# EAGLE design Naninator7 (EAGLE 7.3.0)
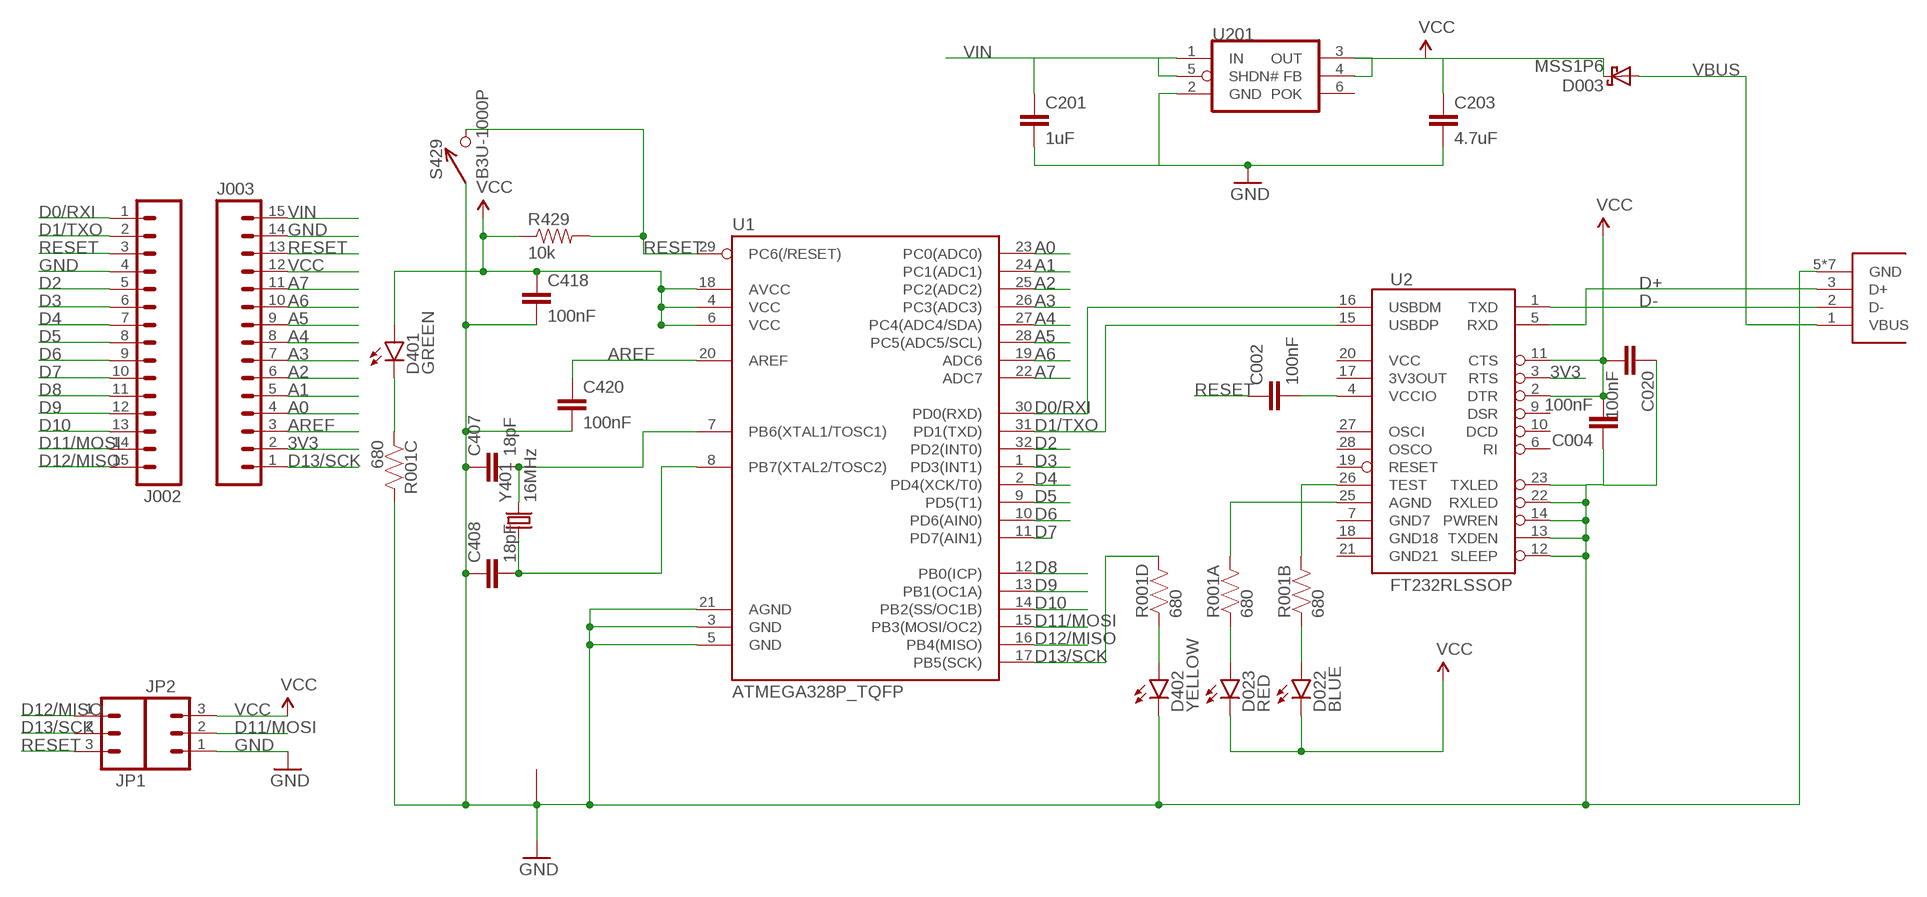
[diagram p0: schematic, sheet 1]

## Parts
C002  100nF  CAP0402-CAP  [0402-CAP]
C004  100nF  CAP0402-CAP  [0402-CAP]
C020  100nF  CAP0402-CAP  [0402-CAP]
C201  1uF  CAP0402-CAP  [0402-CAP]
C203  4.7uF  CAP0402-CAP  [0402-CAP]
C407  18pF  CAP0402-CAP  [0402-CAP]
C408  18pF  CAP0402-CAP  [0402-CAP]
C418  100nF  CAP0402-CAP  [0402-CAP]
C420  100nF  CAP0402-CAP  [0402-CAP]
D003  MSS1P6  [MICROSMP]
D022  BLUE  LED0603  [LED-0603]
D023  RED  LED0603  [LED-0603]
D401  GREEN  LED0603  [LED-0603]
D402  YELLOW  LED0603  [LED-0603]
J001  USB_MICROB_JSTFCI  [USB-MICROB-CONN-09505]
J002  M15  [1X15]
J003  M15  [1X15]
JP1  M03PTH  [1X03]
JP2  M03PTH  [1X03]
R001  680  RP404  [CRA04]
R429  10k  RESISTOR0402-RES  [0402-RES]
S429  B3U-1000P  [B3U-1000P]
U1  ATMEGA328P_TQFP  [TQFP32-08]
U2  FT232RLSSOP  [SSOP28DB]
U201  MAX8881  [SOT-23-6]
Y401  16MHz  CX2520  [CRYSTAL_SMD_2MM_2_5MM]

## Nets
3V3: J003.2 U2.3(RTS)
A0: J003.4 U1.23(PC0(ADC0))
A1: J003.5 U1.24(PC1(ADC1))
A2: J003.6 U1.25(PC2(ADC2))
A3: J003.7 U1.26(PC3(ADC3))
A4: J003.8 U1.27(PC4(ADC4/SDA))
A5: J003.9 U1.28(PC5(ADC5/SCL))
A6: J003.10 U1.19(ADC6)
A7: J003.11 U1.22(ADC7)
AREF: C420.1 J003.3 U1.20(AREF)
D0/RXI: J002.1 U1.30(PD0(RXD)) U2.16(USBDM)
D1/TXO: J002.2 U1.31(PD1(TXD)) U2.15(USBDP)
D2: J002.5 U1.32(PD2(INT0))
D3: J002.6 U1.1(PD3(INT1))
D4: J002.7 U1.2(PD4(XCK/T0))
D5: J002.8 U1.9(PD5(T1))
D6: J002.9 U1.10(PD6(AIN0))
D7: J002.10 U1.11(PD7(AIN1))
D8: J002.11 U1.12(PB0(ICP))
D9: J002.12 U1.13(PB1(OC1A))
D10: J002.13 U1.14(PB2(SS/OC1B))
D11/MOSI: J002.14 JP2.2 U1.15(PB3(MOSI/OC2))
D12/MISO: J002.15 JP1.1 U1.16(PB4(MISO))
D13/SCK: J003.1 JP1.2 R001.5 U1.17(PB5(SCK))
D+: J001.3(D+) U2.5(RXD)
D-: J001.2(D-) U2.1(TXD)
DTR#: C002.2 U2.4(VCCIO)
GND: C004.1 C020.1 C201.2 C203.2 C407.1 C408.1 C418.2 C420.2 D402.C J001.5(GND) J001.P1(GND) J001.P2(GND) J001.P3(GND) J001.P4(GND) J001.P5(GND) J001.P6(GND) J002.4 J003.14 JP2.1 R001.6 S429.P$1 U1.3(GND) U1.5(GND) U1.21(AGND) U2.12(SLEEP) U2.13(TXDEN) U2.14(PWREN) U2.22(RXLED) U2.23(TXLED) U201.2(GND) Y401.2 Y401.4
N$1: C407.2 U1.7(PB6(XTAL1/TOSC1)) Y401.3
N$2: C408.2 U1.8(PB7(XTAL2/TOSC2)) Y401.1
N$3: D401.C R001.3
N$4: D022.A R001.2
N$5: D023.A R001.1
N$8: D402.A R001.4
RESET: C002.1 J002.3 J003.13 JP1.3 R429.2 S429.P$2 U1.29(PC6(/RESET))
RXLED1: R001.8 U2.25(AGND)
TXLED1: R001.7 U2.26(TEST)
VBUS: D003.A J001.1(VBUS)
VCC: C004.2 C020.2 C203.1 C418.1 D003.K D022.C D023.C D401.A J003.12 JP2.3 R429.1 U1.4(VCC) U1.6(VCC) U1.18(AVCC) U2.2(DTR) U2.11(CTS) U201.3(OUT) U201.4(FB)
VIN: C201.1 J003.15 U201.1(IN) U201.5(SHDN#)
Unconnected: U2.6(RI) U2.9(DSR) U2.10(DCD) U2.17(3V3OUT) U2.19(RESET) U2.27(OSCI) U2.28(OSCO) U201.6(POK)

## Power pins joined to a net without a drawn wire
GND7: U2.7(GND7)
GND18: U2.18(GND18)
GND21: U2.21(GND21)
VCC: U2.20(VCC)

## Library data of the parts
C002 C004 C020 C418 C420 = SparkFun:CAP: Capacitor Standard 0603 ceramic capacitor, and 0.1" leaded capacitor.; DIGIKEY: 445-1268-1-ND
C201 = SparkFun:CAP: Capacitor Standard 0603 ceramic capacitor, and 0.1" leaded capacitor.; DIGIKEY: 445-1415-1-ND
C203 = SparkFun:CAP: Capacitor Standard 0603 ceramic capacitor, and 0.1" leaded capacitor.; DIGIKEY: 445-7395-1-ND
C407 C408 = SparkFun:CAP: Capacitor Standard 0603 ceramic capacitor, and 0.1" leaded capacitor.; DIGIKEY: 445-1238-1-ND
D003 = KwanSystems:MSS1P6; DIGIKEY: MSS1P6-M3/89AGICT-ND
D022 = SparkFun-LED:LED: LEDs Standard schematic elements and footprints for 5mm, 3mm, 1206, and 0603 sized LEDs. 5mm - Spark Fun Electronics SKU : COM-00529 (and others); DIGIKEY: 350-2037-1-ND
D023 = SparkFun-LED:LED: LEDs Standard schematic elements and footprints for 5mm, 3mm, 1206, and 0603 sized LEDs. 5mm - Spark Fun Electronics SKU : COM-00529 (and others); DIGIKEY: 754-1359-1-ND
D401 = SparkFun-LED:LED: LEDs Standard schematic elements and footprints for 5mm, 3mm, 1206, and 0603 sized LEDs. 5mm - Spark Fun Electronics SKU : COM-00529 (and others); DIGIKEY: 350-2036-1-ND
D402 = SparkFun-LED:LED: LEDs Standard schematic elements and footprints for 5mm, 3mm, 1206, and 0603 sized LEDs. 5mm - Spark Fun Electronics SKU : COM-00529 (and others); DIGIKEY: 754-1124-1-ND
J001 = KwanSystems:USB_MICROB_JST; DIGIKEY: 455-2562-1-ND
J002 J003 = SparkFun-Connectors:M15: Header 15 Standard 15-pin 0.1" header. Use with straight break away headers (SKU : PRT-00116), right angle break away headers (PRT-00553), swiss pins (PRT-00743), machine pins (PRT-00117), and female headers (PRT-00115).; DIGIKEY: $NOPART
JP1 JP2 = SparkFun-Connectors:M03: Header 3 Standard 3-pin 0.1" header. Use with straight break away headers (SKU : PRT-00116), right angle break away headers (PRT-00553), swiss pins (PRT-00743), machine pins (PRT-00117), and female headers (PRT-00115). Molex polarized connector foot print use with SKU : PRT-08232 with associated crimp pins and housings.; DIGIKEY: $NOPART
R001 = KwanSystems:RP4; DIGIKEY: CRA4S8680CT-ND
R429 = SparkFun-Passives:RESISTOR: Resistor Basic schematic elements and footprints for 0603, 1206, and PTH resistors.; DIGIKEY: P10.0KLCT-ND
S429 = KwanSystems:B3U-1000P
U1 = SparkFun-DigitalIC:ATMEGA328P_TQFP; PROD_ID: IC-09069
U2 = SparkFun-DigitalIC:FT232RL: USB UART FT232RL 4th Generation USB UART (USB <-> Serial) Controller. Spark Fun Electronics SKU : COM-00650 Production SKU IC-00870; PROD_ID: IC-00870
U201 = KwanSystems:MAX8881; DIGIKEY: MAX8881EUT50+TCT-ND
Y401 = KwanSystems:CX2520; DIGIKEY: 478-6955-1-ND

## Net classes
0 default: width 0.152 mm, drill 0.33 mm, clearance 0.152 mm

## Board
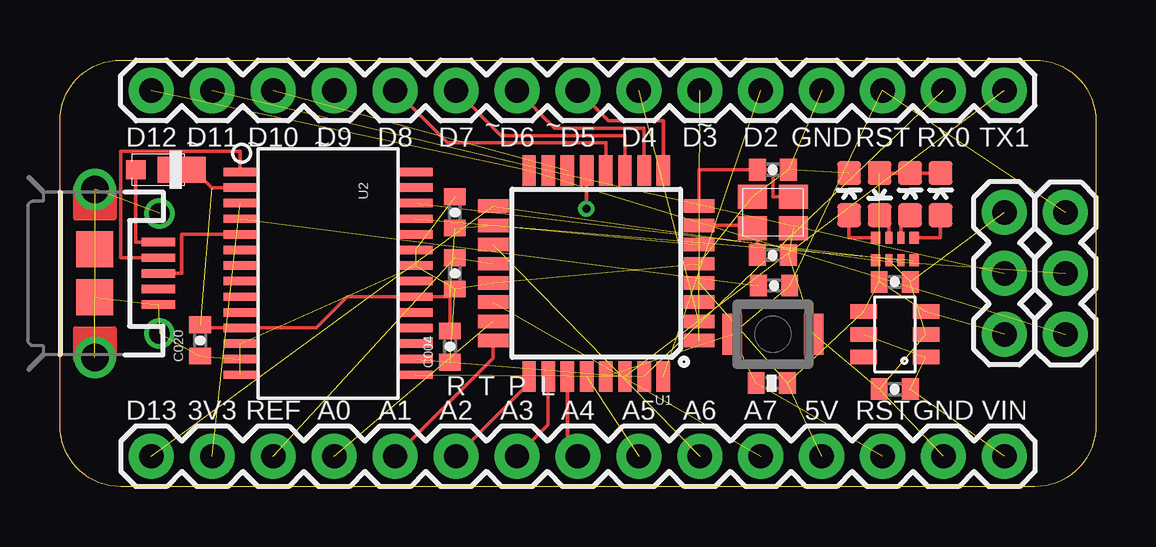
[diagram p1: board, top side]
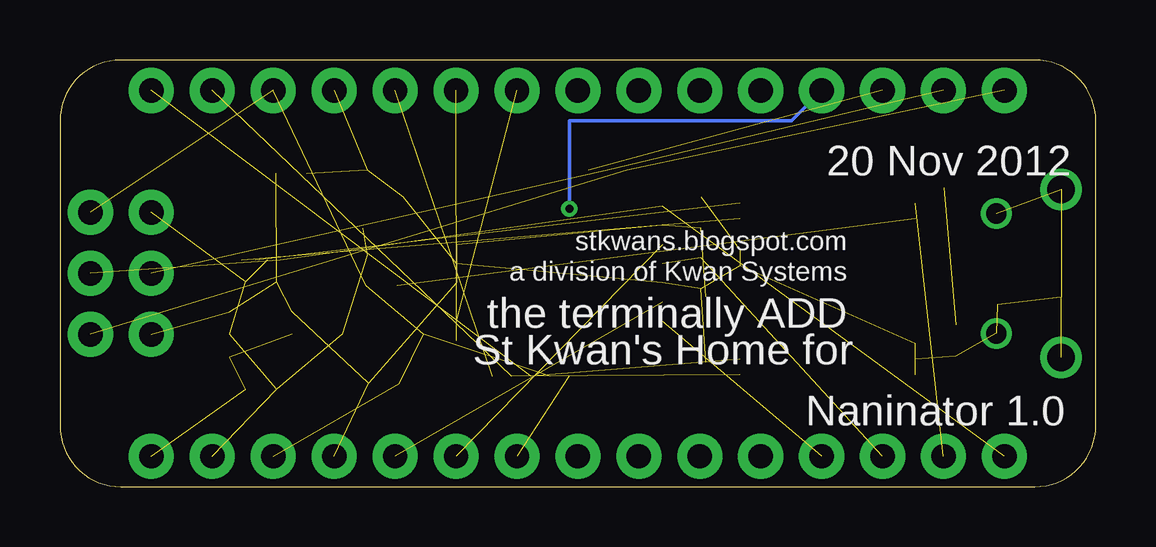
[diagram p2: board, bottom side, seen from below]

Size 43.18 x 17.78 mm. Coordinates in mm from the lower left corner, seen from the top.
Outline: 2.54,17.78 40.64,17.78 arc-90 43.18,15.24 43.18,2.54 arc-90 40.64,0 2.54,0 arc-90 0,2.54 0,15.24 arc-90 2.54,17.78
Copper layers (1*16): Top 0.0356mm / dielectric 1.5011mm / Bottom 0.0356mm
Design rules "default": minimum track width 6mil, minimum drill 13mil, track to track 6mil, track to pad 6mil, pad to pad 6mil, via to via 6mil, smd to smd 6mil, copper to edge 15mil, drill to drill 6mil, minimum pad ring 7mil, minimum via ring 7mil, stop-mask expansion 4mil, vias tented up to drill 14mil, thermal gap 10mil

### Footprints (pad centres in the part's own frame; a part is rotated, then mirrored left to right if it is on the bottom)
0402-CAP = smd 0.7 x 0.9: 1 -0.65,0; 2 0.65,0
MICROSMP = smd 0.8 x 0.8: A 0.9,0 | smd 2 x 1.1: K -1,0
LED-0603 = smd 1 x 1: A 0,-0.877; C 0,0.877
USB-MICROB-CONN-09505 = smd 0.35 x 1.4: 1 -1.3,4.1; 2 -0.65,4.1; 3 0,4.1; 4 0.65,4.1; 5 1.3,4.1 | smd 1.5 x 1.55: P1 -1,1.45; P2 1,1.45 | drill 1.15 pad 1.422: P3 -3.5,1.45; P4 3.5,1.45 | drill 0.85 pad 1.27: P5 -2.5,4.15; P6 2.5,4.15
1X15 = drill 1.016 pad 1.88: 1 0,0; 2 2.54,0; 3 5.08,0; 4 7.62,0; 5 10.16,0; 6 12.7,0; 7 15.24,0; 8 17.78,0; 9 20.32,0; 10 22.86,0; 11 25.4,0; 12 27.94,0; 13 30.48,0; 14 33.02,0; 15 35.56,0
1X03 = drill 1.016 pad 1.88: 1 0,0; 2 2.54,0; 3 5.08,0
CRA04 = smd 0.4 x 0.5: 1 -0.8,-0.475; 4 0.8,-0.475; 5 0.8,0.475; 8 -0.8,0.475 | smd 0.3 x 0.5: 2 -0.25,-0.475; 3 0.25,-0.475; 6 0.25,0.475; 7 -0.25,0.475
0402-RES = smd 0.7 x 0.9: 1 -0.65,0; 2 0.65,0
B3U-1000P = smd 0.8 x 1.7: P$1 -1.7,0; P$2 1.7,0
TQFP32-08 = smd 1.27 x 0.559: 1 -4.293,2.8; 2 -4.293,2; 3 -4.293,1.2; 4 -4.293,0.4; 5 -4.293,-0.4; 6 -4.293,-1.2; 7 -4.293,-2; 8 -4.293,-2.8; 17 4.293,-2.8; 18 4.293,-2; 19 4.293,-1.2; 20 4.293,-0.4; 21 4.293,0.4; 22 4.293,1.2; 23 4.293,2; 24 4.293,2.8 | smd 0.559 x 1.27: 9 -2.8,-4.293; 10 -2,-4.293; 11 -1.2,-4.293; 12 -0.4,-4.293; 13 0.4,-4.293; 14 1.2,-4.293; 15 2,-4.293; 16 2.8,-4.293; 25 2.8,4.293; 26 2,4.293; 27 1.2,4.293; 28 0.4,4.293; 29 -0.4,4.293; 30 -1.2,4.293; 31 -2,4.293; 32 -2.8,4.293
SSOP28DB = smd 0.348 x 1.397: 1 -4.225,-3.656; 2 -3.575,-3.656; 3 -2.925,-3.656; 4 -2.275,-3.656; 5 -1.625,-3.656; 6 -0.975,-3.656; 7 -0.325,-3.656; 8 0.325,-3.656; 9 0.975,-3.656; 10 1.625,-3.656; 11 2.275,-3.656; 12 2.925,-3.656; 13 3.575,-3.656; 14 4.225,-3.656; 15 4.225,3.656; 16 3.575,3.656; 17 2.925,3.656; 18 2.275,3.656; 19 1.625,3.656; 20 0.975,3.656; 21 0.325,3.656; 22 -0.325,3.656; 23 -0.975,3.656; 24 -1.625,3.656; 25 -2.275,3.656; 26 -2.925,3.656; 27 -3.575,3.656; 28 -4.225,3.656
SOT-23-6 = smd 0.6 x 1.1: 1 -0.95,-1.3; 2 0,-1.3; 3 0.95,-1.3; 4 0.95,1.3; 5 0,1.3; 6 -0.95,1.3
CRYSTAL_SMD_2MM_2_5MM = smd 1.2 x 1: 1 -0.85,-0.65; 2 0.85,-0.65; 3 0.85,0.65; 4 -0.85,0.65

### Placement (x,y rotation side)
C002  29.77,8.38 180 top
C004  16.26,5.84 90 top
C020  5.84,6.1 90 top
C201  34.8,4.06 180 top
C203  34.8,8.53 0 top
C407  29.72,9.65 180 top
C408  29.72,13.21 180 top
C418  16.46,11.43 90 top
C420  16.46,8.89 270 top
D003  4.06,13.21 180 top
D022  35.43,12.19 0 top
D023  36.7,12.19 0 top
D401  34.16,12.19 180 top
D402  32.89,12.19 0 top
J001  0,8.89 270 top
J002  39.37,16.51 180 top
J003  3.81,1.27 0 top
JP1  41.91,6.35 90 top
JP2  39.37,11.43 270 top
R001  34.8,9.91 180 top
R429  29.67,4.32 180 top
S429  29.72,6.35 180 top
U1  22.35,8.89 180 top
U2  11.18,8.89 270 top
U201  34.8,6.35 90 top
Y401  29.72,11.43 180 top

### Tracks (layer width: path | path; a pad name or v marks a point on that pad's centre or on a via)
3V3  (1 unrouted)
A0  (1 unrouted)
A1
  Top 0.152: U1.24 18.06,5.36 J003.5
A2
  Top 0.152: U1.25 19.55,4.31 J003.6
A3
  Top 0.152: U1.26 20.35,2.57 J003.7
A4
  Top 0.152: U1.27 21.15,1.71 J003.8
A5  (1 unrouted)
A6  (1 unrouted)
A7  (1 unrouted)
AREF  (2 unrouted)
D0/RXI  (2 unrouted)
D1/TXO  (2 unrouted)
D2  (1 unrouted)
D3  (1 unrouted)
D4  (1 unrouted)
D5
  Top 0.152: J002.8 22.86,15.24 25.15,15.24 U1.9
D6
  Top 0.152: J002.9 20.62,14.94 24.35,14.94 U1.10
D7
  Top 0.152: J002.10 18.39,14.63 23.55,14.63 U1.11
D8
  Top 0.152: J002.11 16.15,14.33 22.75,14.33 U1.12
D9  (via drill 0.33)
  Top 0.152: v21.95,11.58 v21.95,11.59 U1.13
  Bottom 0.152: J002.12 12.7,15.24 21.95,15.24 v21.95,11.58
D10  (1 unrouted)
D11/MOSI  (2 unrouted)
D12/MISO  (2 unrouted)
D13/SCK  (3 unrouted)
D+
  Top 0.152: J001.3 5.08,8.89 5.08,10.52 U2.5
D-
  Top 0.152: J001.2 2.54,9.54 2.54,13.97 7.52,13.97 U2.1
DTR#  (1 unrouted)
GND  (30 unrouted)
N$1
  Top 0.152: U1.7 28.76,10.89 Y401.3 29.07,10.58 C407.2
N$2
  Top 0.152: U1.8 26.64,13.21 C408.2 29.72,13.21 29.72,12.08 Y401.1
N$3
  Top 0.152: R001.3 34.55,10.93 D401.C
N$4
  Top 0.152: R001.2 35.05,10.93 D022.A
N$5
  Top 0.152: R001.1 36.7,10.38 D023.A
N$8
  Top 0.152: R001.4 32.89,10.38 D402.A
RESET  (6 unrouted)
RXLED1  (1 unrouted)
TXLED1  (1 unrouted)
VBUS
  Top 0.152: J001.1 3.16,10.19 D003.A
VCC  (12 unrouted)
  Top 0.152: D003.K 5.59,13.21 6.33,12.46 U2.2 | C020.2 5.84,6.62 U2.11 10.68,6.62 11.98,7.92 U2.20 16.26,7.92 C004.2 | D401.A D022.C D023.C
VIN  (3 unrouted)

### Text on the board
tPlace: D12 | ~ | D11 | ~ | D10 | ~ | D9 | D8 | D7 | ~ | D6 | ~ | D5 | D4 | D3 | ~ | D2 | GND | RST | RX0 | TX1 | R | T | P | L | D13 | 3V3 | REF | A0 | A1 | A2 | A3 | A4 | A5 | A6 | A7 | 5V | RST | GND | VIN
bPlace: 20 Nov 2012 | stkwans.blogspot.com | a division of Kwan Systems | the terminally ADD | St Kwan's Home for | Naninator 1.0